# Altium project PowerDC.PrjPcb
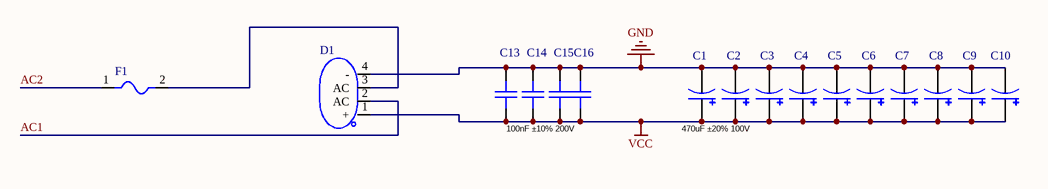
[diagram p0: Sheet1.SchDoc]
1 sheet, 16 parts. Net scope: global (net labels, ports and power ports of the same name join across sheets).
Board file: PCB1.PcbDoc

## Sheet Sheet1.SchDoc
size A4; SheetNumber: 1; SheetTotal: 1

### Parts
C1  LCSC Part Name: 470uF ±20% 100V  [CAP-TH_BD16.0-P7.50-D1.2-FD]
C2  (no value)  [CAP-TH_BD16.0-P7.50-D1.2-FD]
C3  (no value)  [CAP-TH_BD16.0-P7.50-D1.2-FD]
C4  (no value)  [CAP-TH_BD16.0-P7.50-D1.2-FD]
C5  (no value)  [CAP-TH_BD16.0-P7.50-D1.2-FD]
C6  (no value)  [CAP-TH_BD16.0-P7.50-D1.2-FD]
C7  (no value)  [CAP-TH_BD16.0-P7.50-D1.2-FD]
C8  (no value)  [CAP-TH_BD16.0-P7.50-D1.2-FD]
C9  (no value)  [CAP-TH_BD16.0-P7.50-D1.2-FD]
C10  (no value)  [CAP-TH_BD16.0-P7.50-D1.2-FD]
C13  LCSC Part Name: 100nF ±10% 200V  [C1206]
C14  (no value)  [C1206]
C15  (no value)  [C1206]
C16  (no value)  [C1206]
D1  (no value)  [GBU_4P-L22.0-W3.6-P5.08]
F1  (no value)  [F2410]

### Nets
GND: C1.2 C2.2 C3.2 C4.2 C5.2 C6.2 C7.2 C8.2 C9.2 C10.2 C13.2 C14.2 C15.2 C16.2 D1.4(-)
VCC: C1.1 C2.1 C3.1 C4.1 C5.1 C6.1 C7.1 C8.1 C9.1 C10.1 C13.1 C14.1 C15.1 C16.1 D1.1(+)
AC1: D1.2(AC)
AC2: F1.1
NetD1_3: D1.3(AC) F1.2

### Library data of the parts
C1-C10 = KF471M100J250A: Manufacturer: CapXon(台湾丰宾); Add into BOM: yes; Value: 470uF; Tolerance: ±20%; Rated Voltage: 100V; φD: 16mm; L: 25mm; Lifetime @ Temp: 5000hrs@105; Symbol: KF471M100J250A; Device: KF471M100J250A; Supplier Part: C369597; Manufacturer Part: KF471M100J250A; Supplier Footprint: 径向引线,16x25mm; JLCPCB Part Class: Extended Part; Datasheet: https://atta.szlcsc.com/upload/public/pdf/source/20190129/C369597_7164598A1FE2AE81858E4062A572FE81.pdf; Supplier: LCSC; Convert to PCB: yes; Lead Spacing: 7.5mm; Operating Temperature: -
  C2-C10: LCSC Part Name: 470uF ±20% 100V
C13-C16 = CC1206KKX7RABB104: Manufacturer: YAGEO(国巨); Add into BOM: yes; Value: 100nF; Tolerance: ±10%; Voltage Rated: 200V; Temperature Coefficient: X7R; Symbol: CC1206KKX7RABB104; Device: CC1206KKX7RABB104; Supplier Part: C113894; Manufacturer Part: CC1206KKX7RABB104; Supplier Footprint: 1206; JLCPCB Part Class: Extended Part; Datasheet: https://atta.szlcsc.com/upload/public/pdf/source/20170602/1496384493333.pdf; Supplier: LCSC; Convert to PCB: yes
  C14-C16: LCSC Part Name: 100nF ±10% 200V
D1 = GBU801: Manufacturer: 晶导微电子; Add into BOM: yes; Reverse Voltage (Vr): 100V; Average Rectified Current (Io): 8A; Forward Voltage (Vf@If): 1V@4A; Reverse Leakage Current (Ir): 5A@100V; Peak Forward Surge Current: 200A; Symbol: GBU801; Device: GBU801; LCSC Part Name: 100V 8A; Supplier Part: C438425; Manufacturer Part: GBU801; Supplier Footprint: GBU; JLCPCB Part Class: Extended Part; Datasheet: https://atta.szlcsc.com/upload/public/pdf/source/20191021/C438425_805E5DEDEC0DA9CA2A5D2B9251B6BCA3.pdf; Supplier: LCSC; Convert to PCB: yes; Operating Temperature: -55~+150@(Tj)
F1 = JFC2410-1800FS: Manufacturer: JDTfuse集电通; Add into BOM: yes; Fuse Type: 快速熔断; Current Rating: 8A; Rated Voltage(AC): 250V; Nominal Cold Resistance: 7mΩ; Breaking Capacity @ Rated Voltage: 50A; Melting I²t: 235.18; Symbol: JFC2410-1800FS; Device: JFC2410-1800FS; LCSC Part Name: 8A 250V 快断; Supplier Part: C136373; Manufacturer Part: JFC2410-1800FS; Supplier Footprint: SMD; JLCPCB Part Class: Extended Part; Datasheet: https://atta.szlcsc.com/upload/public/pdf/source/20171023/C136373_15087481036331053507.pdf; Supplier: LCSC; Convert to PCB: yes; Product: 贴片式保险丝; Rated Voltage(DC): -; Nominal Voltage Drop: -; Operating Temperature: -55°C ~ 125°C